# Altium schematic sheet 01 COVER PAGE.SchDoc
size A3; SheetNumber: 1; SheetTotal: 3
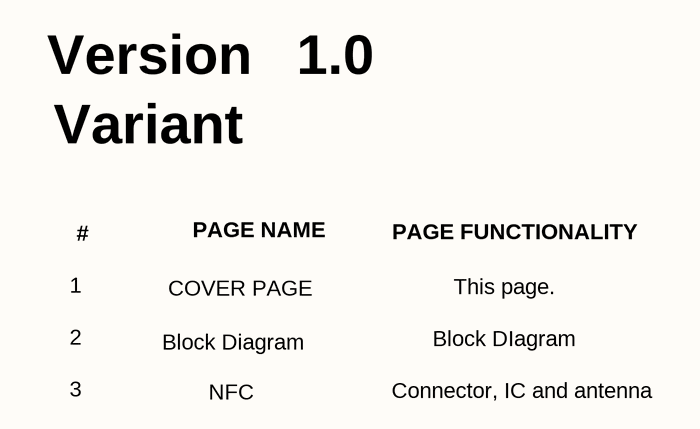
[diagram p0: 01 COVER PAGE.SchDoc]

## Notes on the sheet
- Version
- 1.0
- Variant
- #
- PAGE NAME
- COVER PAGE
- PAGE FUNCTIONALITY
- This page.
- 1
- 2
- Block Diagram
- Block DIagram
- 3
- NFC
- Connector, IC and antenna
- Size
- Author
- Revision
- embedded-consultants.com <http://embedded-consultants.com>
- Sheet
- Date
- of